# EAGLE design test_schematic (EAGLE 9.5.2)
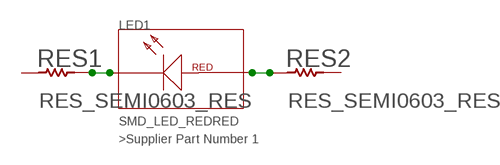
[diagram p0: schematic, sheet 1]

## Parts
LED1  SMD_LED_REDRED  [0603_LED_RED]
RES1  RES_SEMI0603_RES  [0603_RESISTOR]
RES2  RES_SEMI0603_RES  [0603_RESISTOR]

## Nets
N$1: LED1.1(K) RES1.2
N$2: LED1.2(A) RES2.1
Unconnected: RES1.1 RES2.2

## Library data of the parts
LED1 = test:SMD_LED_RED: LED RED; DEVICE: Wurth Electronics Inc.; MANUFACTURER_PART_NUMBER: 150060RS75000
RES1 RES2 = test:RES_SEMI: Semiconductor Resistor; LINK: Name http://www.rohm.com/web/global/datasheet/ESR01MZPF/esr-e; MANUFACTURER_PART_NUMBER: 311-619KHRCT-ND; VENDOR: DIGIKEY

## Board
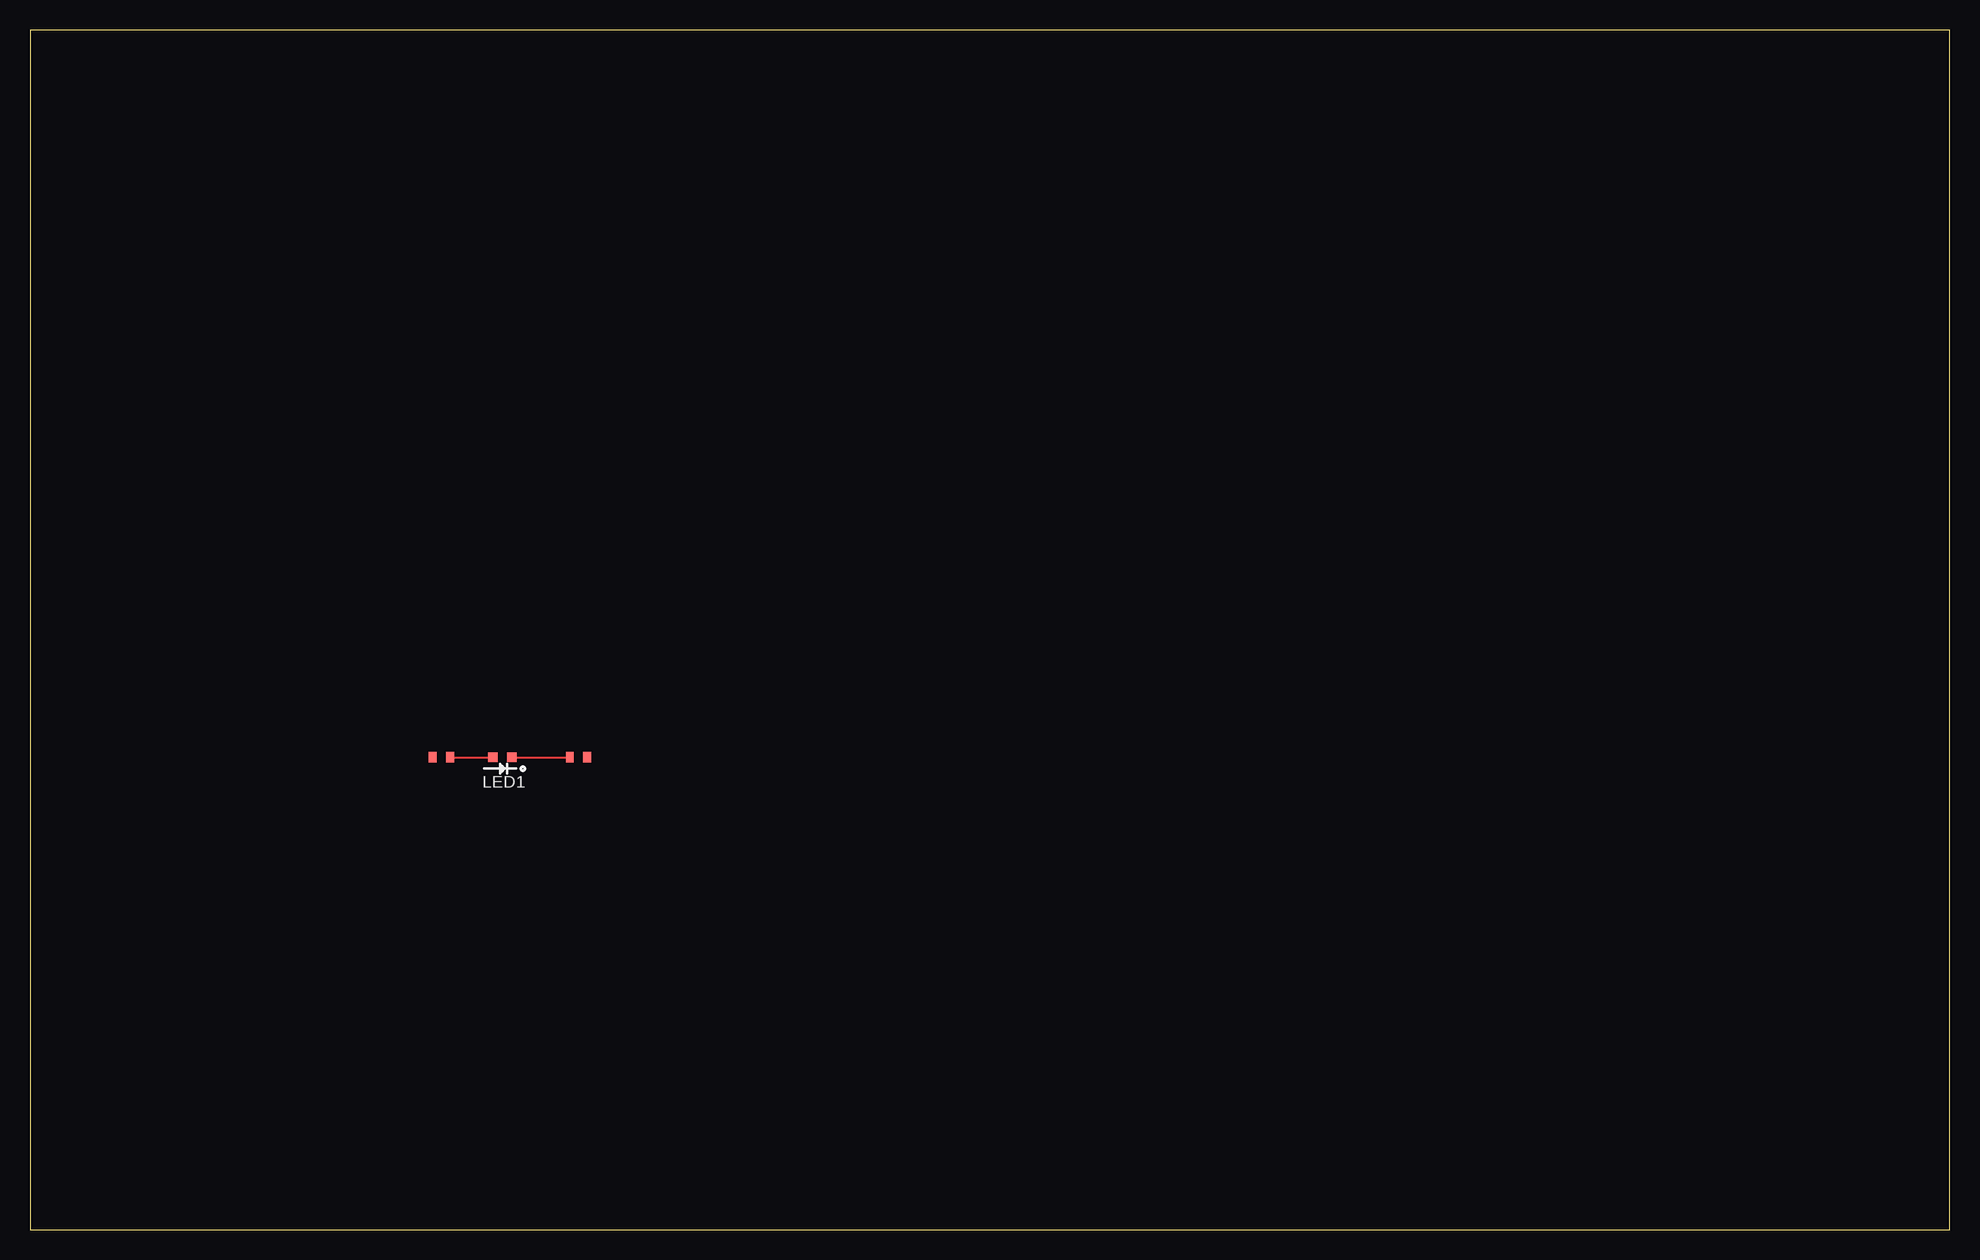
[diagram p1: board, top side]

Size 160 x 100 mm. Coordinates in mm from the lower left corner, seen from the top.
Outline: 0,0 160,0 160,100 0,100 0,0
Copper layers (1*16): Top 0.035mm / dielectric 1.5mm / Bottom 0.035mm
Design rules "default": minimum track width 6mil, minimum drill 0.35mm, track to track 6mil, track to pad 6mil, pad to pad 6mil, via to via 6mil, smd to smd 6mil, copper to edge 40mil, drill to drill 6mil, minimum pad ring 10mil, minimum via ring 8mil, stop-mask expansion 4mil, vias tented up to drill 0mil, thermal gap 10mil

### Footprints (pad centres in the part's own frame; a part is rotated, then mirrored left to right if it is on the bottom)
0603_LED_RED = smd 0.8 x 0.8: 1 -0.8,0; 2 0.8,0
0603_RESISTOR = smd 0.65 x 0.9: 1 -0.725,0; 2 0.725,0

### Placement (x,y rotation side)
LED1  39.37,39.37 180 top
RES1  45.72,39.37 180 top
RES2  34.29,39.37 180 top

### Tracks (layer width: path | path; a pad name or v marks a point on that pad's centre or on a via)
N$1
  Top 0.152: LED1.1 RES1.2
N$2
  Top 0.152: RES2.1 LED1.2